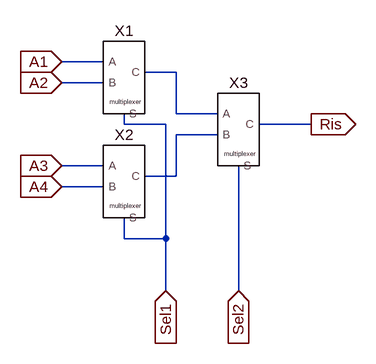
[diagram p0: schematic multiplexer_2x4.asc]
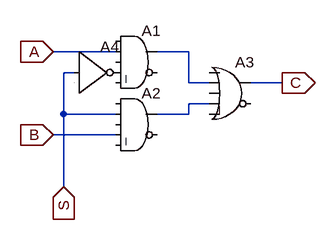
[diagram p1: sub-circuit multiplexer.asc]
multiplexer_2x4.asc, the LTspice schematic file:
Version 4
SHEET 1 880 680
WIRE 128 128 64 128
WIRE 240 144 192 144
WIRE 128 160 64 160
WIRE 240 208 240 144
WIRE 304 208 240 208
WIRE 160 224 160 208
WIRE 224 224 160 224
WIRE 448 224 368 224
WIRE 304 240 240 240
WIRE 128 288 64 288
WIRE 240 304 240 240
WIRE 240 304 192 304
WIRE 128 320 64 320
WIRE 160 400 160 368
WIRE 224 400 224 224
WIRE 224 400 160 400
WIRE 224 480 224 400
WIRE 336 480 336 288
FLAG 64 128 A1
IOPIN 64 128 In
FLAG 64 160 A2
IOPIN 64 160 In
FLAG 64 288 A3
IOPIN 64 288 In
FLAG 64 320 A4
IOPIN 64 320 In
FLAG 224 480 Sel1
IOPIN 224 480 In
FLAG 336 480 Sel2
IOPIN 336 480 In
FLAG 448 224 Ris
IOPIN 448 224 Out
SYMBOL multiplexer 160 144 R0
SYMATTR InstName X1
SYMBOL multiplexer 160 304 R0
SYMATTR InstName X2
SYMBOL multiplexer 336 224 R0
SYMATTR InstName X3

multiplexer.asc, the sub-circuit schematic file:
Version 4
SHEET 1 880 680
WIRE 48 112 -48 112
WIRE 160 112 112 112
WIRE -16 144 -32 144
WIRE 160 160 160 112
WIRE 192 160 160 160
WIRE 304 160 256 160
WIRE 192 192 160 192
WIRE -32 208 -32 144
WIRE 48 208 -32 208
WIRE 160 208 160 192
WIRE 160 208 112 208
WIRE 48 240 -48 240
WIRE -32 320 -32 208
FLAG -48 112 A
IOPIN -48 112 In
FLAG -48 240 B
IOPIN -48 240 In
FLAG -32 320 S
IOPIN -32 320 In
FLAG 304 160 C
IOPIN 304 160 Out
SYMBOL Digital\\and 80 64 R0
SYMATTR InstName A1
SYMBOL Digital\\and 80 160 R0
SYMATTR InstName A2
SYMBOL Digital\\or 224 112 R0
SYMATTR InstName A3
SYMBOL Digital\\inv -16 80 R0
SYMATTR InstName A4

The netlist it stands for:
* multiplexer_2x4.asc
XX1 A1 A2 Sel1 N001 multiplexer params: multiplexer
XX2 A3 A4 Sel1 N002 multiplexer params: multiplexer
XX3 N001 N002 Sel2 Ris multiplexer params: multiplexer

* block symbol definitions
.subckt multiplexer A B S C
A1 0 A 0 P001 0 0 N001 0 AND
A2 0 S 0 B 0 0 N002 0 AND
A3 0 N001 0 N002 0 0 C 0 OR
A4 S 0 0 0 0 P001 0 0 BUF
.ends multiplexer

.backanno
.end